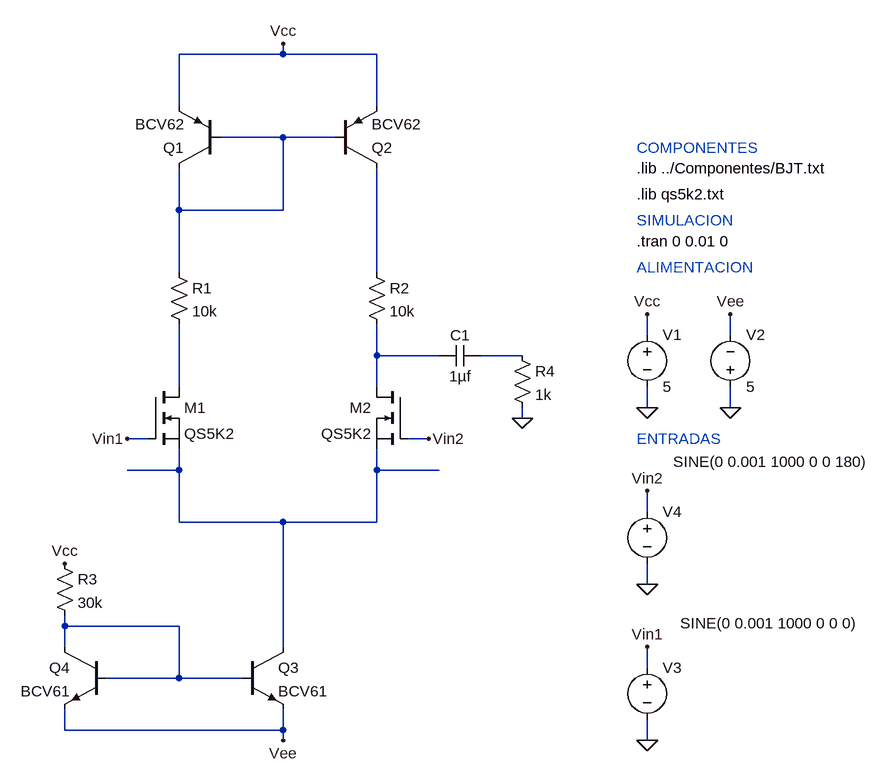
[diagram p0: schematic simulacion.asc]
simulacion.asc, the LTspice schematic file:
Version 4
SHEET 1 1252 828
WIRE -64 -368 -64 -384
WIRE -64 -368 -224 -368
WIRE 80 -368 -64 -368
WIRE -224 -288 -224 -368
WIRE 80 -288 80 -368
WIRE -64 -240 -160 -240
WIRE 16 -240 -64 -240
WIRE -224 -128 -224 -192
WIRE -64 -128 -64 -240
WIRE -64 -128 -224 -128
WIRE -224 -32 -224 -128
WIRE 80 -32 80 -192
WIRE 496 64 496 32
WIRE 624 64 624 32
WIRE 80 96 80 48
WIRE 176 96 80 96
WIRE 304 96 240 96
WIRE -224 144 -224 48
WIRE 80 144 80 96
WIRE 496 176 496 144
WIRE 624 176 624 144
WIRE 304 192 304 176
WIRE -272 224 -304 224
WIRE 160 224 128 224
WIRE -224 272 -224 240
WIRE -224 272 -304 272
WIRE 80 272 80 240
WIRE 176 272 80 272
WIRE 496 336 496 304
WIRE -224 352 -224 272
WIRE -64 352 -224 352
WIRE 80 352 80 272
WIRE 80 352 -64 352
WIRE 496 448 496 416
WIRE -64 464 -64 352
WIRE -400 512 -400 496
WIRE -224 512 -400 512
WIRE -400 544 -400 512
WIRE -64 544 -64 464
WIRE 496 576 496 544
WIRE -224 592 -224 512
WIRE -224 592 -336 592
WIRE -128 592 -224 592
WIRE -400 672 -400 640
WIRE -64 672 -64 640
WIRE -64 672 -400 672
WIRE -64 688 -64 672
WIRE 496 688 496 656
FLAG 496 176 0
FLAG 624 176 0
FLAG 496 32 Vcc
FLAG 624 32 Vee
FLAG -64 -384 Vcc
FLAG 496 448 0
FLAG 496 688 0
FLAG -64 688 Vee
FLAG -400 416 Vcc
FLAG -304 224 Vin1
FLAG 496 304 Vin2
FLAG 496 544 Vin1
FLAG 160 224 Vin2
FLAG 304 192 0
DATAFLAG -304 272 ""
DATAFLAG 176 272 ""
DATAFLAG -64 464 "Ic(Q3)"
DATAFLAG 80 96 ""
SYMBOL voltage 496 48 R0
WINDOW 123 0 0 Left 2
WINDOW 39 0 0 Left 2
SYMATTR InstName V1
SYMATTR Value 5
SYMBOL voltage 624 160 M180
WINDOW 0 24 96 Left 2
WINDOW 3 24 16 Left 2
WINDOW 123 0 0 Left 2
WINDOW 39 0 0 Left 2
SYMATTR InstName V2
SYMATTR Value 5
SYMBOL voltage 496 560 R0
WINDOW 3 51 -52 Left 2
WINDOW 123 0 0 Left 2
WINDOW 39 0 0 Left 2
SYMATTR Value SINE(0 0.001 1000 0 0 0)
SYMATTR InstName V3
SYMBOL voltage 496 320 R0
WINDOW 3 40 -61 Left 2
WINDOW 123 0 0 Left 2
WINDOW 39 0 0 Left 2
SYMATTR Value SINE(0 0.001 1000 0 0 180)
SYMATTR InstName V4
SYMBOL npn -128 544 R0
SYMATTR InstName Q3
SYMATTR Value BCV61
SYMBOL npn -336 544 M0
SYMATTR InstName Q4
SYMATTR Value BCV61
SYMBOL res -416 400 R0
SYMATTR InstName R3
SYMATTR Value 30k
SYMBOL nmos -272 144 R0
SYMATTR InstName M1
SYMATTR Value QS5K2
SYMATTR Prefix X
SYMBOL nmos 128 144 M0
SYMATTR InstName M2
SYMATTR Value QS5K2
SYMATTR Prefix X
SYMBOL pnp -160 -192 R180
SYMATTR InstName Q1
SYMATTR Value BCV62
SYMBOL pnp 16 -192 M180
SYMATTR InstName Q2
SYMATTR Value BCV62
SYMBOL res -240 -48 R0
SYMATTR InstName R1
SYMATTR Value 10k
SYMBOL res 64 -48 R0
SYMATTR InstName R2
SYMATTR Value 10k
SYMBOL res 288 80 R0
SYMATTR InstName R4
SYMATTR Value 1k
SYMBOL cap 240 80 R90
WINDOW 0 0 32 VBottom 2
WINDOW 3 32 32 VTop 2
SYMATTR InstName C1
SYMATTR Value 1µf
TEXT 480 -192 Left 2 !.lib ../Componentes/BJT.txt
TEXT 480 -80 Left 2 !.tran 0 0.01 0
TEXT 480 -152 Left 2 !.lib qs5k2.txt
TEXT 480 -224 Left 2 ;COMPONENTES
TEXT 480 -112 Left 2 ;SIMULACION
TEXT 480 -40 Left 2 ;ALIMENTACION
TEXT 480 224 Left 2 ;ENTRADAS

The netlist it stands for:
* simulacion.asc
V1 Vcc 0 5
V2 0 Vee 5
V3 Vin1 0 SINE(0 0.001 1000 0 0 0)
V4 Vin2 0 SINE(0 0.001 1000 0 0 180)
Q3 N006 N007 Vee 0 BCV61
Q4 N007 N007 Vee 0 BCV61
R3 Vcc N007 30k
XM1 N005 Vin1 N006 QS5K2  ; pins D G S
XM2 N003 Vin2 N006 QS5K2  ; pins D G S
Q1 N001 N001 Vcc 0 BCV62
Q2 N002 N001 Vcc 0 BCV62
R1 N001 N005 10k
R2 N002 N003 10k
R4 N004 0 1k
C1 N004 N003 1µf
.model NPN NPN
.model PNP PNP
.lib standard.bjt
.lib ../Componentes/BJT.txt
.tran 0 0.01 0
.lib qs5k2.txt
* COMPONENTES
* SIMULACION
* ALIMENTACION
* ENTRADAS
.backanno
.end